# Altium schematic sheet Sheet1.SchDoc
size A4
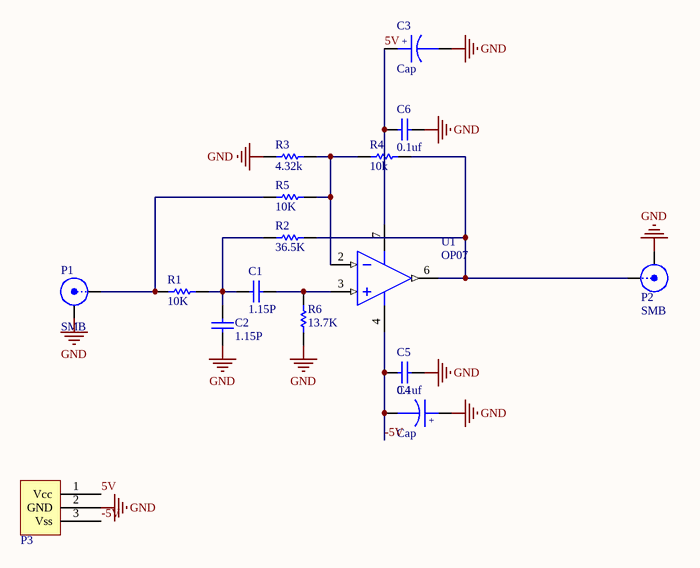
[diagram p0: Sheet1.SchDoc]

## Parts
C1  1.15P  [0805]
C2  1.15P  [0805]
C3  Cap  [3216C-TYPE_A]
C4  Cap  [3216C-TYPE_A]
C5  0.1uf  [0805]
C6  0.1uf  [0805]
P1  SMB  [SMB_V-RJ45]
P2  SMB  [SMB_V-RJ45]
P3  XH2.54-3p  [XH2.54-3p]  (value not drawn)
R1  10K  [0805]
R2  36.5K  [0805]
R3  4.32k  [0805]
R4  10k  [0805]
R5  10K  [0805]
R6  13.7K  [0805]
U1  OP07  [TI-JG8]

## Nets
GND: C2.1 C3.2 C4.1 C5.2 C6.2 P1.2(Y) P2.2(Y) P3.2(GND) R3.1 R6.1
5V: C3.1 C6.1 P3.1(Vcc) U1.7(V+)
-5V: C4.2 C5.1 P3.3(Vss) U1.4(V-)
NetC1_1: C1.1 C2.2 R1.2 R2.1
NetC1_2: C1.2 R6.2 U1.3(IN+)
NetP1_1: P1.1(X) R1.1 R5.1
NetP2_1: P2.1(X) R2.2 R4.2 U1.6(OUT)
NetR3_2: R3.2 R4.1 R5.2 U1.2(IN-)

## Notes on the sheet
- (in symbol Tantalium Cap) +

## Library data of the parts
C1 C2 C5 C6 = Cap
C3 C4 = Tantalium Cap
P1 P2 = SMB: SMB Straight Connector; LatestRevisionDate: 17-Jul-2002; LatestRevisionNote: Re-released for DXP Platform.; Publisher: Altium Limited
R1-R6 = Res